# Altium schematic sheet isolation.SchDoc
size A4
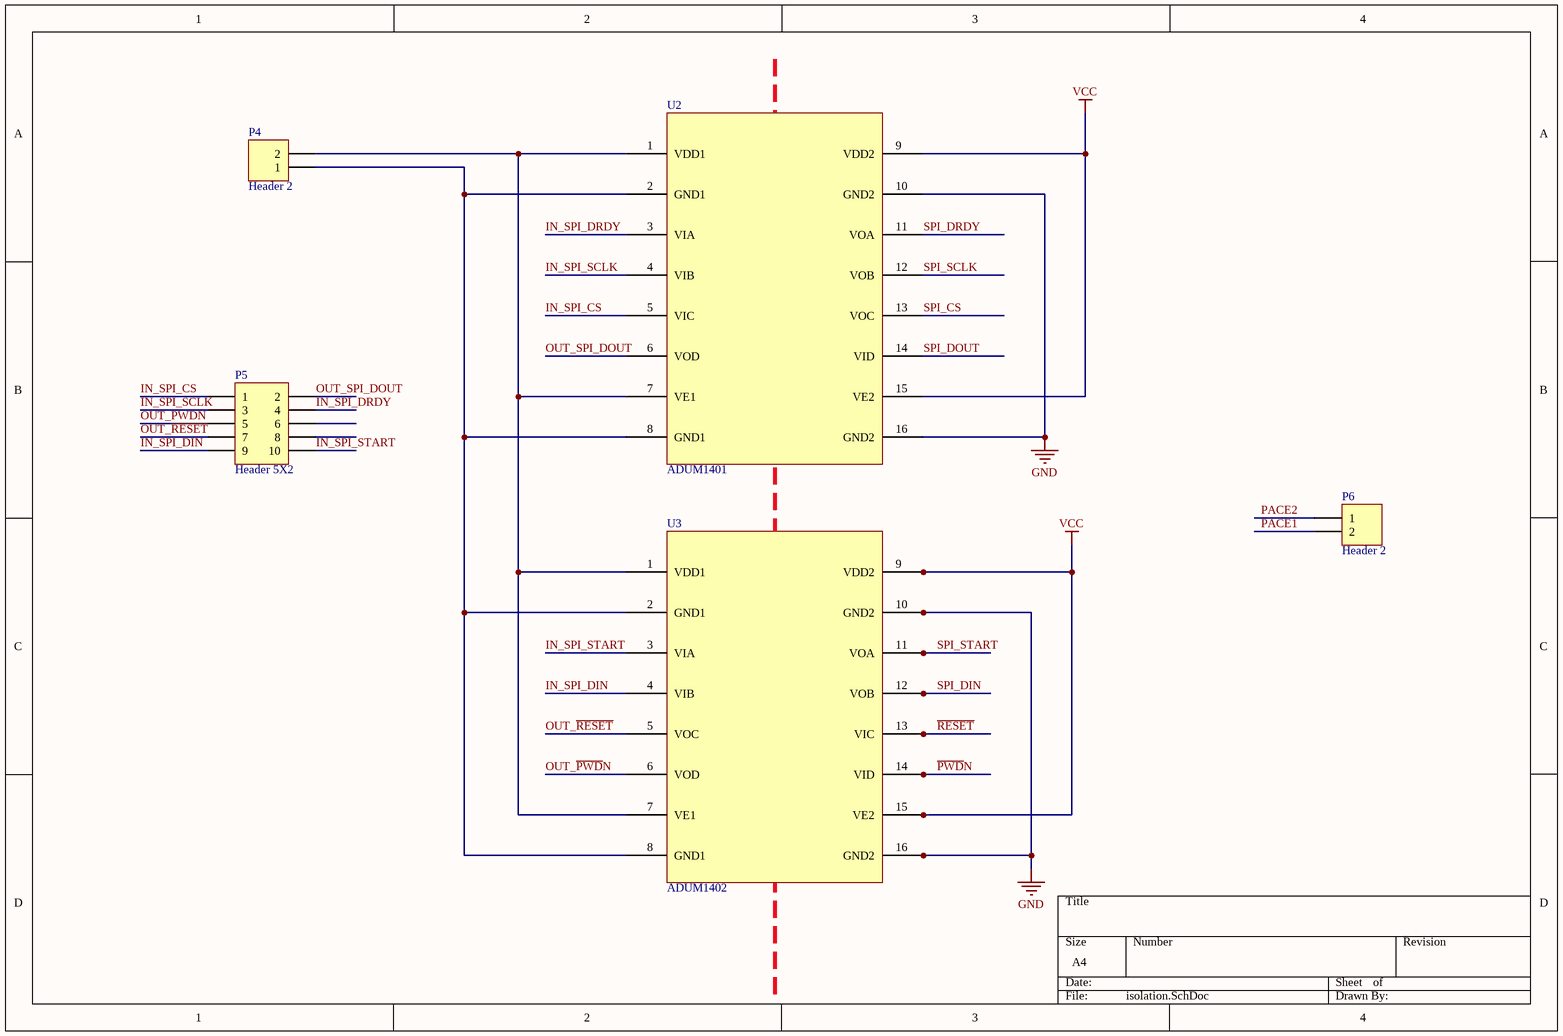
[diagram p0: isolation.SchDoc]

## Parts
P4  Header 2  [HDR1X2]
P5  Header 5X2  [HDR2X5]
P6  Header 2  [HDR1X2]
U2  ADUM1401  [SOIC_W]
U3  ADUM1402  [SOIC_W]

## Nets
GND: U2.10(GND2) U2.16(GND2) U3.10(GND2) U3.16(GND2)
VCC: U2.9(VDD2) U2.15(VE2) U3.9(VDD2) U3.15(VE2)
IN_SPI_CS: P5.1 U2.5(VIC)
IN_SPI_DIN: P5.9 U3.4(VIB)
IN_SPI_DRDY: P5.4 U2.3(VIA)
IN_SPI_SCLK: P5.3 U2.4(VIB)
IN_SPI_START: P5.10 U3.3(VIA)
OUT_~{PWD}N: P5.5 U3.6(VOD)
OUT_~{RESET}: P5.7 U3.5(VOC)
OUT_SPI_DOUT: P5.2 U2.6(VOD)
~{PWD}N: U3.14(VID)
PACE1: P6.2
PACE2: P6.1
~{RESET}: U3.13(VIC)
SPI_CS: U2.13(VOC)
SPI_DIN: U3.12(VOB)
SPI_DOUT: U2.14(VID)
SPI_DRDY: U2.11(VOA)
SPI_SCLK: U2.12(VOB)
SPI_START: U3.11(VOA)
NetP4_1: P4.1 U2.2(GND1) U2.8(GND1) U3.2(GND1) U3.8(GND1)
NetP4_2: P4.2 U2.1(VDD1) U2.7(VE1) U3.1(VDD1) U3.7(VE1)

Not connected (* = marked no-connect by the designer): P5 6 8

## Library data of the parts
P4 P6 = Header 2: Header, 2-Pin; LatestRevisionDate: 17-Jul-2002; LatestRevisionNote: Re-released for DXP Platform.; Publisher: Altium Limited
P5 = Header 5X2: Header, 5-Pin, Dual row; LatestRevisionDate: 17-Jul-2002; LatestRevisionNote: Re-released for DXP Platform.; Publisher: Altium Limited
U2 = ADUM1401: ADI isolation